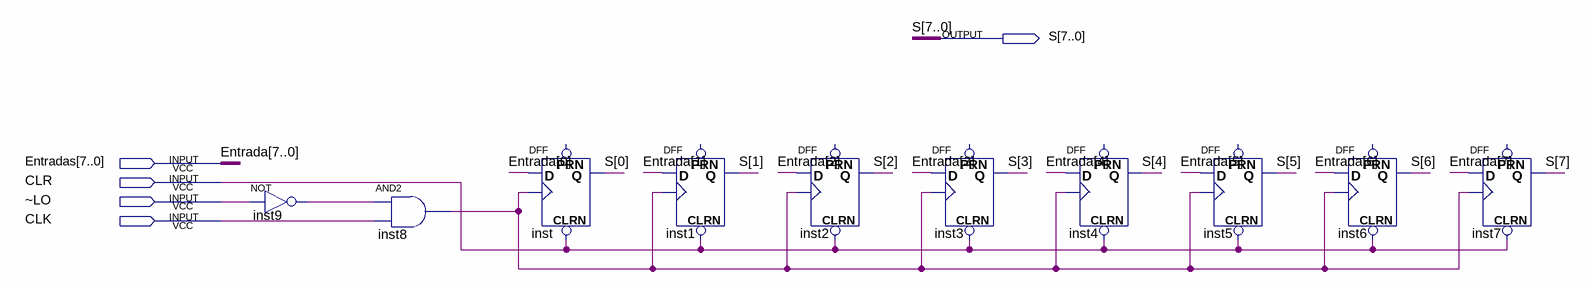
[diagram p0: schematic sheet]
// Quartus schematic Registrador_De_Saida.bdf as structural Verilog: 10 symbols, 5 pins
module Registrador_De_Saida (
  input  [7:0] Entradas,
  input  CLR,
  input  \~LO ,
  input  CLK,
  output [7:0] S
);

  wire inst8_out, inst9_out;

  not inst9 (inst9_out, \~LO );
  and inst8 (inst8_out, inst9_out, CLK);
  DFF inst (.CLRN(CLR), .CLK(inst8_out), .D(Entradas[0]), .Q(S[0]));  // open: PRN
  DFF inst1 (.CLRN(CLR), .CLK(inst8_out), .D(Entradas[1]), .Q(S[1]));  // open: PRN
  DFF inst2 (.CLRN(CLR), .CLK(inst8_out), .D(Entradas[2]), .Q(S[2]));  // open: PRN
  DFF inst3 (.CLRN(CLR), .CLK(inst8_out), .D(Entradas[3]), .Q(S[3]));  // open: PRN
  DFF inst4 (.CLRN(CLR), .CLK(inst8_out), .D(Entradas[4]), .Q(S[4]));  // open: PRN
  DFF inst5 (.CLRN(CLR), .CLK(inst8_out), .D(Entradas[5]), .Q(S[5]));  // open: PRN
  DFF inst6 (.CLRN(CLR), .CLK(inst8_out), .D(Entradas[6]), .Q(S[6]));  // open: PRN
  DFF inst7 (.CLRN(CLR), .CLK(inst8_out), .D(Entradas[7]), .Q(S[7]));  // open: PRN

  // Other names for the same wires on the sheet: Entrada[7:0] = Entradas
endmodule
